# Altium schematic sheet CHM_CPU_FPGA_TIMER32.SchDoc
size A4
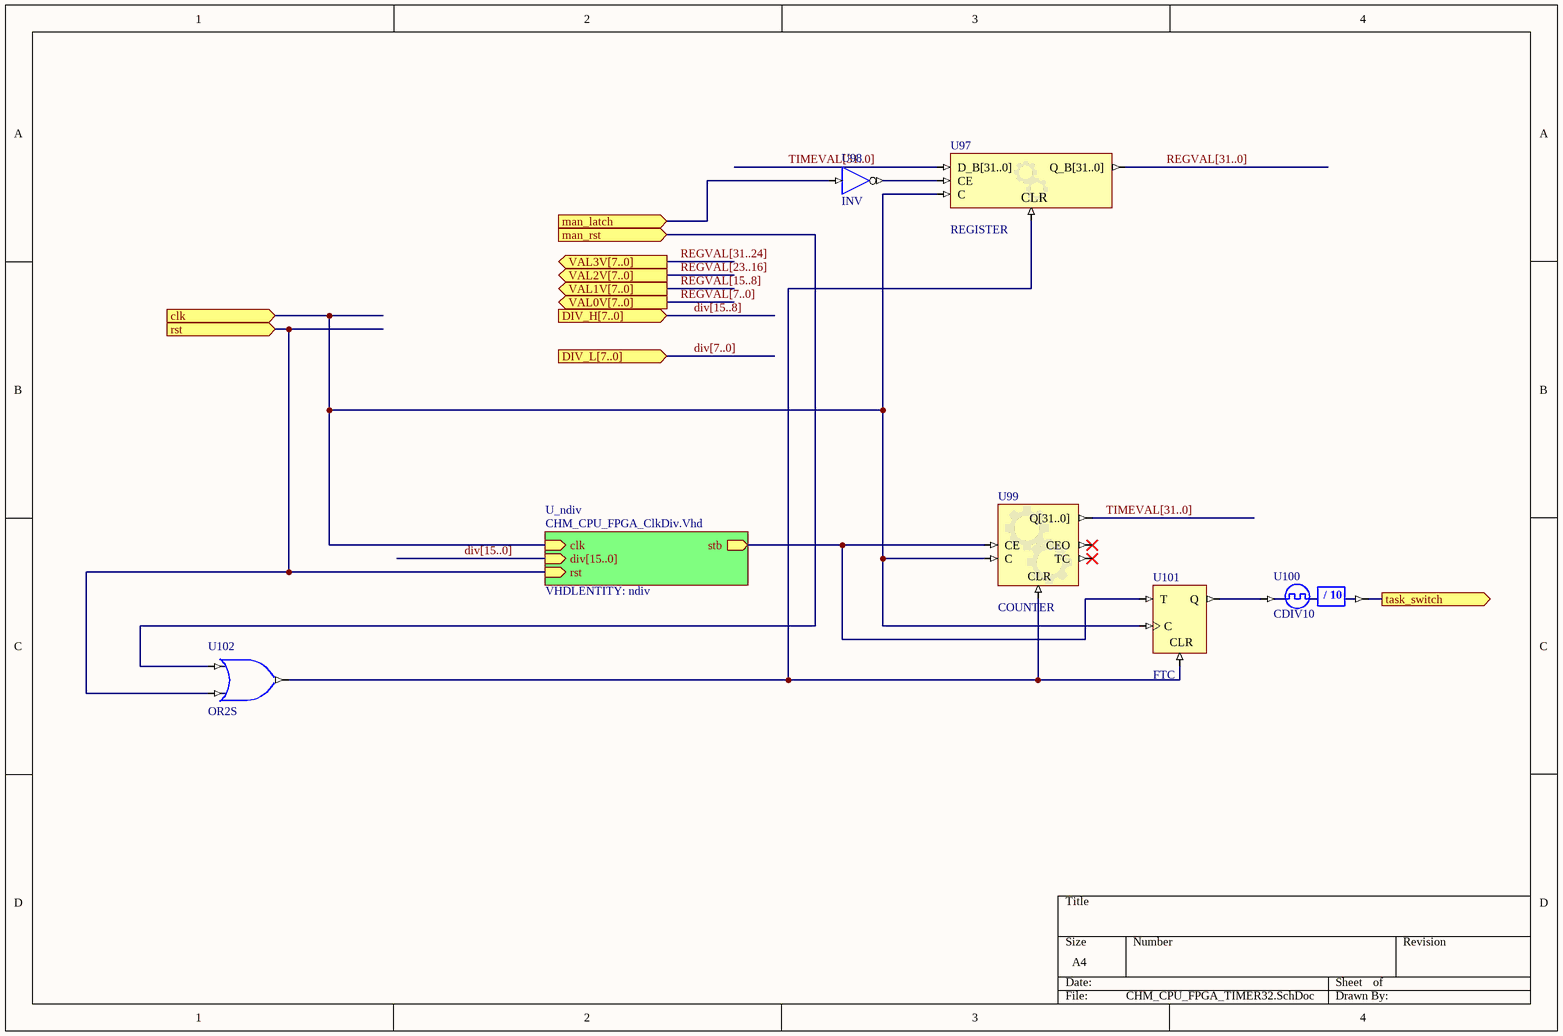
[diagram p0: CHM_CPU_FPGA_TIMER32.SchDoc]

## Parts
U97  REGISTER
U98  INV
U99  COUNTER
U100  CDIV10
U101  FTC
U102  OR2S

## Sub-sheets
U_ndiv = CHM_CPU_FPGA_ClkDiv.Vhd: clk (in), div[15..0] (in), rst (in), stb (out)  | VHDLENTITY: ndiv

## Ports
clk (in), DIV_H[7..0] (in), DIV_L[7..0] (in), man_latch (in), man_rst (in), rst (in), task_switch (out), VAL0V[7..0] (out), VAL1V[7..0] (out), VAL2V[7..0] (out), VAL3V[7..0] (out)

## Nets
clk: U97.C U99.C U101.C ; port clk, sheet U_ndiv/clk
man_latch: U98.I ; port man_latch
man_rst: U102.I0 ; port man_rst
REGVAL[31..0]: U97.Q_B[31..0]
rst: U102.I1 ; port rst, sheet U_ndiv/rst
task_switch: U100.CLKDV ; port task_switch
TIMEVAL[31..0]: U97.D_B[31..0] U99.Q[31..0]
NetU97_CE: U97.CE U98.O
NetU97_CLR: U97.CLR U99.CLR U101.CLR U102.O
NetU99_CE: U99.CE U101.T ; sheet U_ndiv/stb
NetU100_CLKIN: U100.CLKIN U101.Q

Not connected (* = marked no-connect by the designer): U99 CEO* TC*

## Buses and harness runs
bus div[7..0] = port DIV_L[7..0]
bus div[15..0] = sheet U_ndiv/div[15..0]
bus div[15..8] = port DIV_H[7..0]
bus REGVAL[7..0] = port VAL0V[7..0]
bus REGVAL[15..8] = port VAL1V[7..0]
bus REGVAL[23..16] = port VAL2V[7..0]
bus REGVAL[31..0]
bus REGVAL[31..24] = port VAL3V[7..0]
bus TIMEVAL[31..0]

## Notes on the sheet
- (in symbol CDIV10) / 10

## Library data of the parts
U97 = REGISTER: Configurable Register; ConfiguratorName: GENERIC_REGISTER; ConfigurationParameters: {}Version[1.1]{}RegisterType[DFlipFlop]{}NegativeTrigger[False]{}TriggerEnable[True]{}ResetMode[Asynchronous]{}SetMode[None]{}SignalCount[1]{}SignalWidth0[32]{}OutputOption0[Normal]{}; LastRevisionNo: 1.00.00; Published: 13-Oct-2008; Publisher: Altium Limited; HelpURL: https://wiki.altium.com/display/ADOH/Configurable+Generic+Library
U98 = INV: Inverter; FunctionalClass: Logic Primitive; ArchiveName: GENERIC; VHDLIB_SIM: GENERIC_LIB; Published: 29-Jan-2004; Publisher: Altium Limited; XilinxEquivalent: INV; LastRevisionNo: 1.00.00; HelpURL: CR0118 FPGA Generic Library Guide.pdf#page=291; ComponentLink1URL: CR0136 FPGA Logic Primitive Resource Usage.pdf#page=61; ComponentLink1Description: Core &Resource Usage; SubClass: INV
U99 = COUNTER: Configurable Counter; ConfiguratorName: GENERIC_COUNTER; ConfigurationParameters: {}Version[1.0]{}Type[Binary]{}SyncReset[False]{}NegativeClockEdge[False]{}FixedDirection[True]{}IsIncrement[True]{}SignalWidth[32]{}MaxValue[4294967295]{}BusOutput[True]{}Loadable[False]{}BusInput[False]{}; LastRevisionNo: 1.00.00; Published: 14-Jan-2009; Publisher: Altium Limited
U100 = CDIV10: Clock Divider by 10; DivisorRate: 10; ArchiveName: GENERIC; VHDLIB_SIM: GENERIC_LIB; Published: 29-Jan-2004; Publisher: Altium Limited; LastRevisionNo: 1.00.00; HelpURL: CR0118 FPGA Generic Library Guide.pdf#page=142; ComponentLink1URL: CR0127 FPGA Clock Divider Resource Usage.pdf#page=14; ComponentLink1Description: Core &Resource Usage; FunctionalClass: Clock Divider
U101 = FTC: Toggle Flip-Flop with Toggle Enable and Asynchronous Clear; SubClass: T; ClockTrigger: Rising; Enable: High; ArchiveName: GENERIC; VHDLIB_SIM: GENERIC_LIB; Published: 29-Jan-2004; Publisher: Altium Limited; XilinxEquivalent: FTC; LastRevisionNo: 1.00.00; HelpURL: CR0118 FPGA Generic Library Guide.pdf#page=252; ComponentLink1URL: CR0133 FPGA Flip Flop Resource Usage.pdf#page=220; ComponentLink1Description: Core &Resource Usage; FunctionalClass: Flip-Flop; Reset: Asynchronous
U102 = OR2S: 2-Input OR Gate, Single Pin Version; XilinxEquivalent: OR2; FunctionalClass: Logic Primitive; PortSize: 2; ArchiveName: GENERIC; VHDLIB_SIM: GENERIC_LIB; Published: 29-Jan-2004; Publisher: Altium Limited; LastRevisionNo: 1.00.00; HelpURL: CR0118 FPGA Generic Library Guide.pdf#page=410; ComponentLink1URL: CR0136 FPGA Logic Primitive Resource Usage.pdf#page=190; ComponentLink1Description: Core &Resource Usage; SubClass: OR; PortStyle: Single Pin Version